# Altium schematic sheet Adder.SchDoc
size A; SheetNumber: 1; SheetTotal: 7
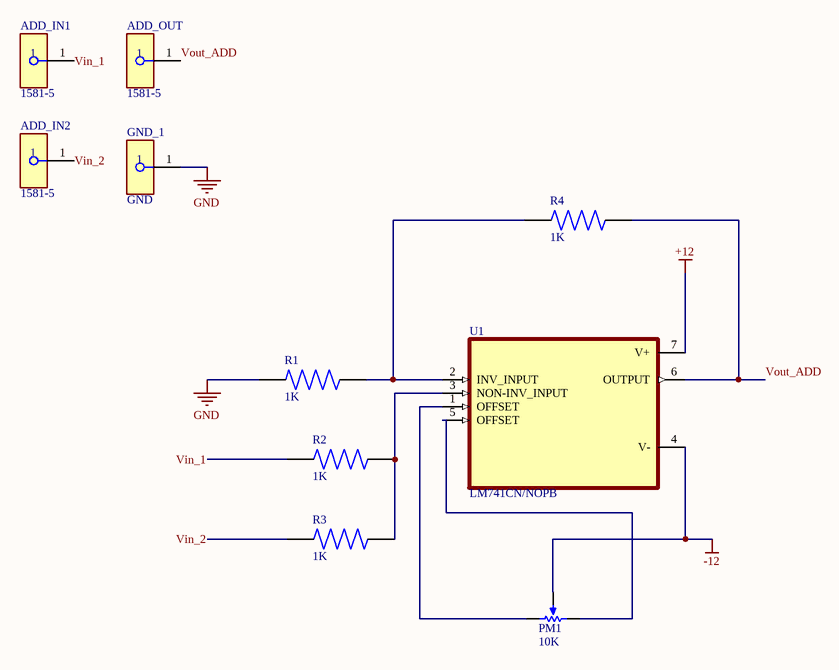
[diagram p0: Adder.SchDoc]

## Parts
ADD_IN1  1581-5  [FP-1581-5-MFG]
ADD_IN2  1581-5  [FP-1581-5-MFG]
ADD_OUT  1581-5  [FP-1581-5-MFG]
GND_1  GND  [FP-1581-5-MFG]
PM1  10K  [PCBComponent_1]
R1  1K  [RESAD1100W55L680D260]
R2  1K  [RESAD1100W55L680D260]
R3  1K  [RESAD1100W55L680D260]
R4  1K  [RESAD1100W55L680D260]
U1  LM741CN/NOPB  [DIP794W45P254L959H508Q8]

## Nets
+12: U1.7(V+)
-12: PM1.2(S) U1.4(V-)
GND: GND_1.1 R1.1
Vin_1: ADD_IN1.1 R2.1
Vin_2: ADD_IN2.1 R3.1
Vout_ADD: ADD_OUT.1 R4.2 U1.6(OUTPUT)
NetPM1_1: PM1.1(CCW) U1.5(OFFSET)
NetPM1_3: PM1.3(CW) U1.1(OFFSET)
NetR1_2: R1.2 R4.1 U1.2(INV_INPUT)
NetR2_2: R2.2 R3.2 U1.3(NON-INV_INPUT)

## Library data of the parts
ADD_IN1 ADD_IN2 ADD_OUT GND_1 = CMP-73906-000011-1: CONN BANANA JACK TURRET GREEN; Body Material: PC; Number of Contacts: 1; Max Current Rating: 15A; Voltage Rating (AC): 30V; Insulation: Mating End Insulated; Voltage Rating: 2.5kV; Voltage Rating (DC): 60V; Gender: Female; Height: 0.25inch; Mount: Panel; RoHS Compliant: Yes; Length: 1.22inch; Orientation: Straight; Diameter: 4.22mm; Lead Free: Lead Free; Package Quantity: 1; Termination: Turret; Current Rating: 15A; Packaging: Bag; Series: 1581; REACH SVHC: No SVHC; Number of Positions: 1; Contact Plating: Tin; Housing Color: Green; Contact Material: Brass; Insulation Material: Polycarbonate; Weight: 0.126lb; Number of Ports: 1; Color: Green; Housing Material: Polycarbonate; Width: 4inch
PM1 = Component_1
R1-R4 = MFR-25FBF52-1K: 1.07 kOhms Â±1% 0.25W, 1/4W Through Hole Resistor Axial - Metal Film; MF: Yageo; SnapEDA_Link: https://www.snapeda.com/parts/MFR-25FBF52-1K/Yageo/view-part/?ref=snap; Package: RADIAL-2 YAGEO; Value: *; MP: MFR-25FBF52-1K; Check_prices: https://www.snapeda.com/parts/MFR-25FBF52-1K/Yageo/view-part/?ref=eda
U1 = LM741CN/NOPB: Single, 44-V, 1-MHz operational amplifier; MF: Texas Instruments; SnapEDA_Link: https://www.snapeda.com/parts/LM741CN/NOPB/Texas+Instruments/view-part/?ref=snap; Package: PDIP-8 Texas; Value: *; MP: LM741CN/NOPB; Check_prices: https://www.snapeda.com/parts/LM741CN/NOPB/Texas+Instruments/view-part/?ref=eda